# EAGLE schematic svf1 (EAGLE 7.2.0)
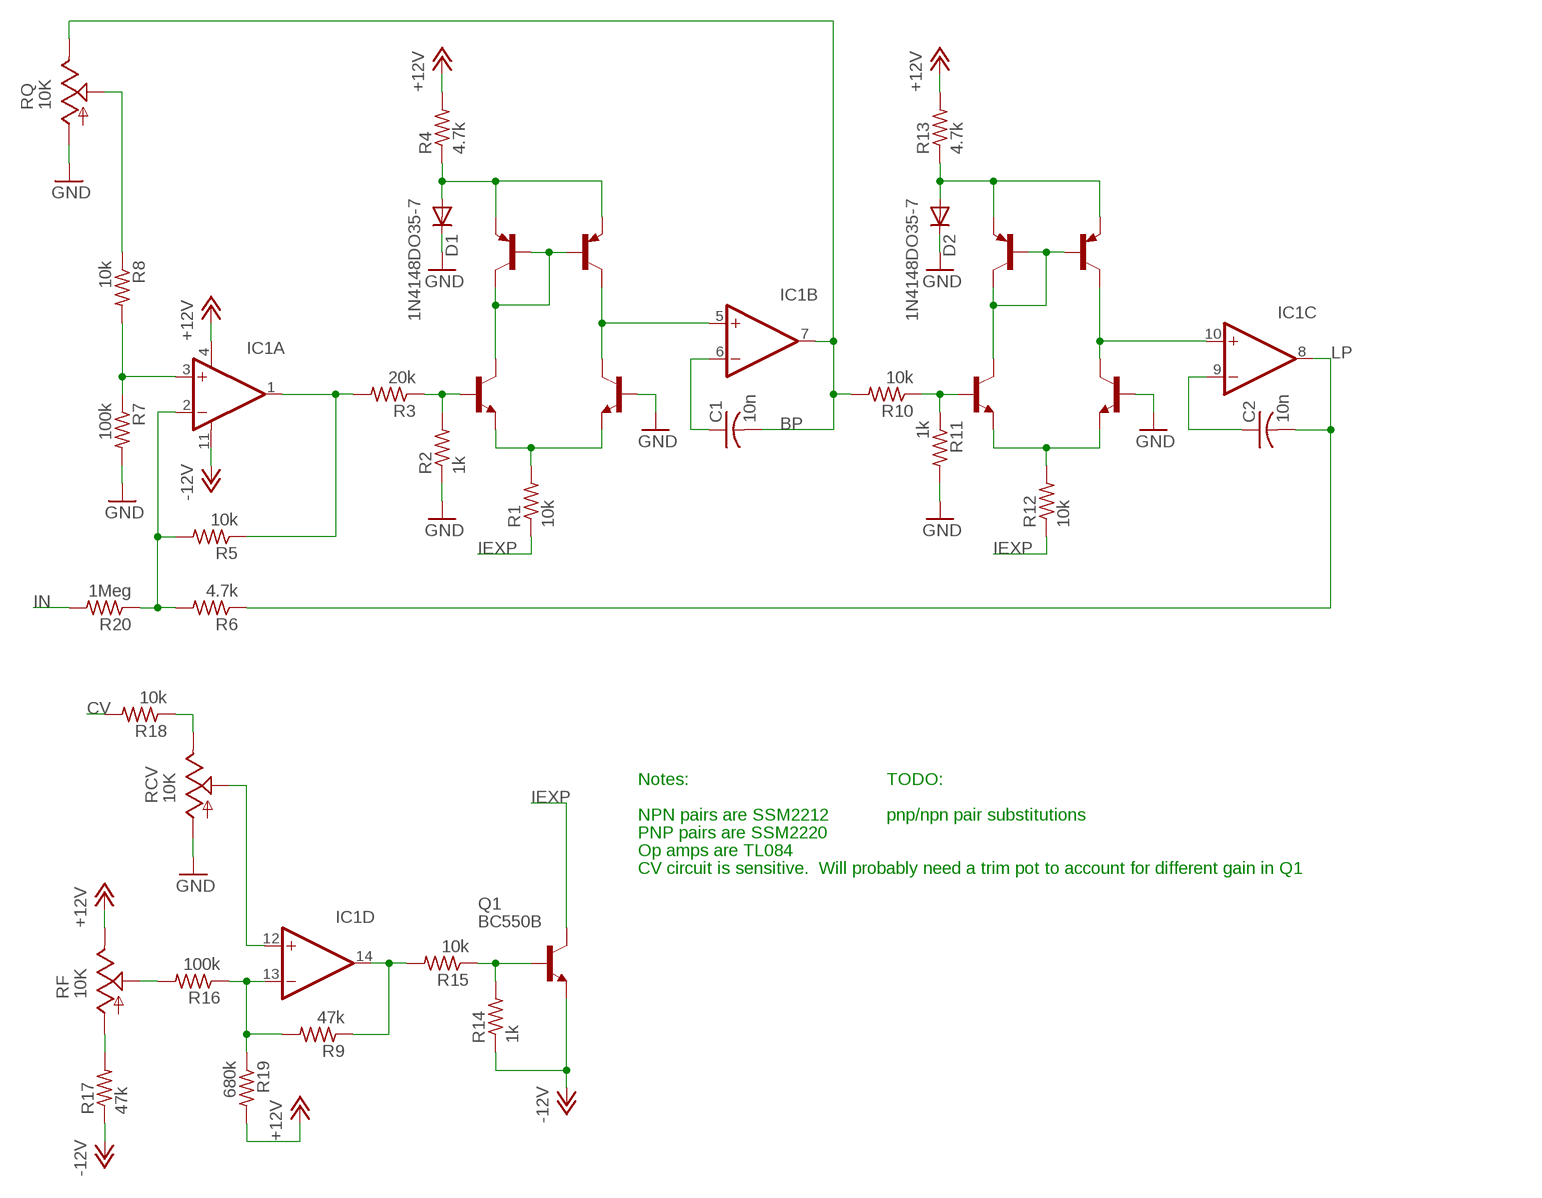
[diagram p0: schematic, sheet 1]

## Parts
C1  10n  C-US075-032X103  [C075-032X103]
C2  10n  C-US075-032X103  [C075-032X103]
D1  1N4148DO35-7  [DO35-7]
D2  1N4148DO35-7  [DO35-7]
IC1  OPA4130P  [DIL14]
Q1  BC550B  [TO92-EBC]
R1  10k  R-US_0207/2V  [0207/2V]
R2  1k  R-US_0207/2V  [0207/2V]
R3  20k  R-US_0207/2V  [0207/2V]
R4  4.7k  R-US_0207/2V  [0207/2V]
R5  10k  R-US_0207/2V  [0207/2V]
R6  4.7k  R-US_0207/2V  [0207/2V]
R7  100k  R-US_0207/2V  [0207/2V]
R8  10k  R-US_0207/2V  [0207/2V]
R9  47k  R-US_0207/2V  [0207/2V]
R10  10k  R-US_0207/2V  [0207/2V]
R11  1k  R-US_0207/2V  [0207/2V]
R12  10k  R-US_0207/2V  [0207/2V]
R13  4.7k  R-US_0207/2V  [0207/2V]
R14  1k  R-US_0207/2V  [0207/2V]
R15  10k  R-US_0207/2V  [0207/2V]
R16  100k  R-US_0207/2V  [0207/2V]
R17  47k  R-US_0207/2V  [0207/2V]
R18  10k  R-US_0207/2V  [0207/2V]
R19  680k  R-US_0207/2V  [0207/2V]
R20  1Meg  R-US_0207/2V  [0207/2V]
RCV  10K  US-EVUF3J  [EVUFXJ]
RF  10K  US-EVUF3J  [EVUFXJ]
RQ  10K  US-EVUF3J  [EVUFXJ]
U$1  BCM847  [SOT457R_PHILIPS]
U$2  BCM857  [SOT457R_PHILIPS]
U$4  BCM847  [SOT457R_PHILIPS]
U$5  BCM857  [SOT457R_PHILIPS]

## Nets
+12V: IC1.4(A:V+) R4.2 R13.2 R19.2 RF.3(E)
-12V: IC1.11(A:V-) Q1.E R14.1 R17.1
BP: C1.2 IC1.7(B:OUT) R10.2 RQ.3(E)
CV: R18.1 RCV.3(E)
GND: D1.C D2.C R2.1 R7.2 R11.2 RCV.1(A) RQ.1(A) U$1.5(B) U$4.5(B)
IEXP: Q1.C R1.1 R12.1
IN: R20.2
LP: C2.2 IC1.8(C:OUT) R6.1
N$1: R12.2 U$4.1(E) U$4.4(E)
N$2: IC1.5(B:+IN) U$1.3(C) U$2.3(C)
N$3: D1.A R4.1 U$2.1(E) U$2.4(E)
N$4: U$1.6(C) U$2.2(B) U$2.5(B) U$2.6(C)
N$5: R1.2 U$1.1(E) U$1.4(E)
N$6: R2.2 R3.1 U$1.2(B)
N$7: IC1.2(A:-IN) R5.2 R6.2 R20.1
N$8: IC1.1(A:OUT) R3.2 R5.1
N$9: IC1.3(A:+IN) R7.1 R8.2
N$10: IC1.10(C:+IN) U$4.3(C) U$5.3(C)
N$11: C1.1 IC1.6(B:-IN)
N$12: R8.1 RQ.2(S)
N$13: IC1.13(D:-IN) R9.2 R16.1 R19.1
N$14: U$4.6(C) U$5.2(B) U$5.5(B) U$5.6(C)
N$15: R10.1 R11.1 U$4.2(B)
N$16: IC1.12(D:+IN) RCV.2(S)
N$17: D2.A R13.1 U$5.1(E) U$5.4(E)
N$18: C2.1 IC1.9(C:-IN)
N$19: R16.2 RF.2(S)
N$20: R17.2 RF.1(A)
N$21: Q1.B R14.2 R15.1
N$22: IC1.14(D:OUT) R9.1 R15.2
N$23: R18.2

## Notes on the sheet
- Notes: | TODO:
- NPN pairs are SSM2212 | pnp/npn pair substitutions
- PNP pairs are SSM2220
- Op amps are TL084
- CV circuit is sensitive.  Will probably need a trim pot to account for different gain in Q1

## Library data of the parts
C1 C2 = dan:C-US: CAPACITOR, American symbol
D1 D2 = dan:1N4148: DIODE high speed (Philips)
IC1 = dan:OPA4130: Low Power, Precision FET-Input Operational Amplifiers; OC_FARNELL: unknown; OC_NEWARK: unknown
Q1 = dan:BC550*: NPN Transistor
R1-R20 = dan:R-US_: RESISTOR, American symbol
RCV RF RQ = dan:US-EVU: 9 mm Square Rotary Potentiometers Source: Panasonic
U$1 U$4 = dan:BCM847
U$2 U$5 = dan:BCM857